# Altium schematic sheet CSI.SchDoc
size A3; SheetNumber: 1; SheetTotal: 1; PageSetup: Record=PageOptions|CenterHorizontal=True|CenterVertical=True|PrintScale=0.97|XCorrection=1.00|YCorrection=1.00|PrintKind=1|BorderSize=5000000|LeftOffset=0|BottomOffset=0|Orientation=2|PaperLength=2970|PaperWidth=2100|Scale=100|PaperSource=7|PrintQuality=600|MediaType=1|DitherType=10|PaperKind=A4|PrintScaleMode=1
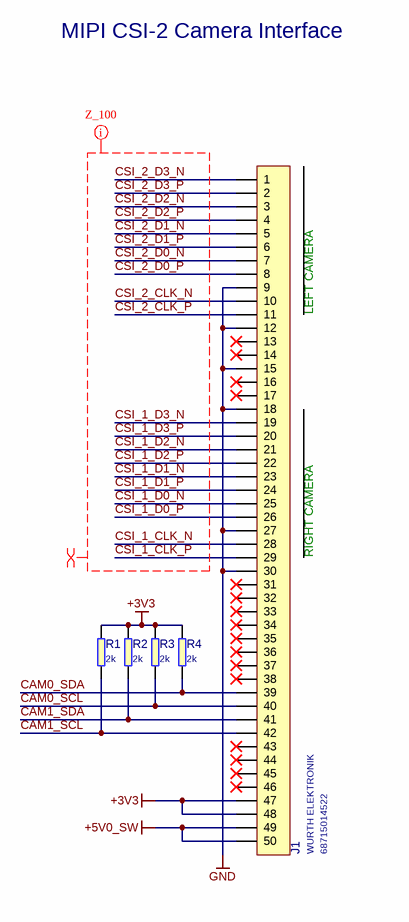
[diagram p0: CSI.SchDoc]

## Parts
J1  68715014522  Manufacturer: WURTH ELEKTRONIK  [68715014522]
R1  2k  [0402]
R2  2k  [0402]
R3  2k  [0402]
R4  2k  [0402]

## Nets
+3V3: J1.47 J1.48 R1.1 R2.1 R3.1 R4.1
+5V0_SW: J1.49 J1.50
GND: J1.9 J1.12 J1.15 J1.18 J1.27 J1.30
CAM0_SCL: J1.40 R3.2
CAM0_SDA: J1.39 R4.2
CAM1_SCL: J1.42 R1.2
CAM1_SDA: J1.41 R2.2
CSI_1_CLK_N: J1.28
CSI_1_CLK_P: J1.29
CSI_1_D0_N: J1.25
CSI_1_D0_P: J1.26
CSI_1_D1_N: J1.23
CSI_1_D1_P: J1.24
CSI_1_D2_N: J1.21
CSI_1_D2_P: J1.22
CSI_1_D3_N: J1.19
CSI_1_D3_P: J1.20
CSI_2_CLK_N: J1.10
CSI_2_CLK_P: J1.11
CSI_2_D0_N: J1.7
CSI_2_D0_P: J1.8
CSI_2_D1_N: J1.5
CSI_2_D1_P: J1.6
CSI_2_D2_N: J1.3
CSI_2_D2_P: J1.4
CSI_2_D3_N: J1.1
CSI_2_D3_P: J1.2

Not connected (* = marked no-connect by the designer): J1 13* 14* 16* 17* 31* 32* 33* 34* 35* 36* 37* 38* 43* 44* 45* 46*

## Layout directives
net class Z_100: CSI_1_CLK_N, CSI_1_CLK_P, CSI_1_D0_N, CSI_1_D0_P, CSI_1_D1_N, CSI_1_D1_P, CSI_1_D2_N, CSI_1_D2_P, CSI_1_D3_N, CSI_1_D3_P, CSI_2_CLK_N, CSI_2_CLK_P, CSI_2_D0_N, CSI_2_D0_P, CSI_2_D1_N, CSI_2_D1_P, CSI_2_D2_N, CSI_2_D2_P, CSI_2_D3_N, CSI_2_D3_P
differential pair: CSI_1_CLK_N, CSI_1_CLK_P, CSI_1_D0_N, CSI_1_D0_P, CSI_1_D1_N, CSI_1_D1_P, CSI_1_D2_N, CSI_1_D2_P, CSI_1_D3_N, CSI_1_D3_P, CSI_2_CLK_N, CSI_2_CLK_P, CSI_2_D0_N, CSI_2_D0_P, CSI_2_D1_N, CSI_2_D1_P, CSI_2_D2_N, CSI_2_D2_P, CSI_2_D3_N, CSI_2_D3_P

## Notes on the sheet
- MIPI CSI-2 Camera Interface
- (near J1) LEFT CAMERA
- (near J1) RIGHT CAMERA
- Title:
- Size:
- Date:
- Status:
- A3
- Revision:
- Page:
- of
- Antmicro Ltd
- www.antmicro.com
- File:

## Library data of the parts
J1 = WE-687-150-145-22: 0.50mm SMT ZIF Horizontal Bottom Contact WR-FPC; Value: 68715014522; PartNumber: 68715014522
R1-R4 = R_2k_0402: SMT Resistor 2k 0402; PartNumber: R_2k_0402; Value: 2k